# Altium project T8_SOM_Carrier.PrjPcb (part 1 of 4)
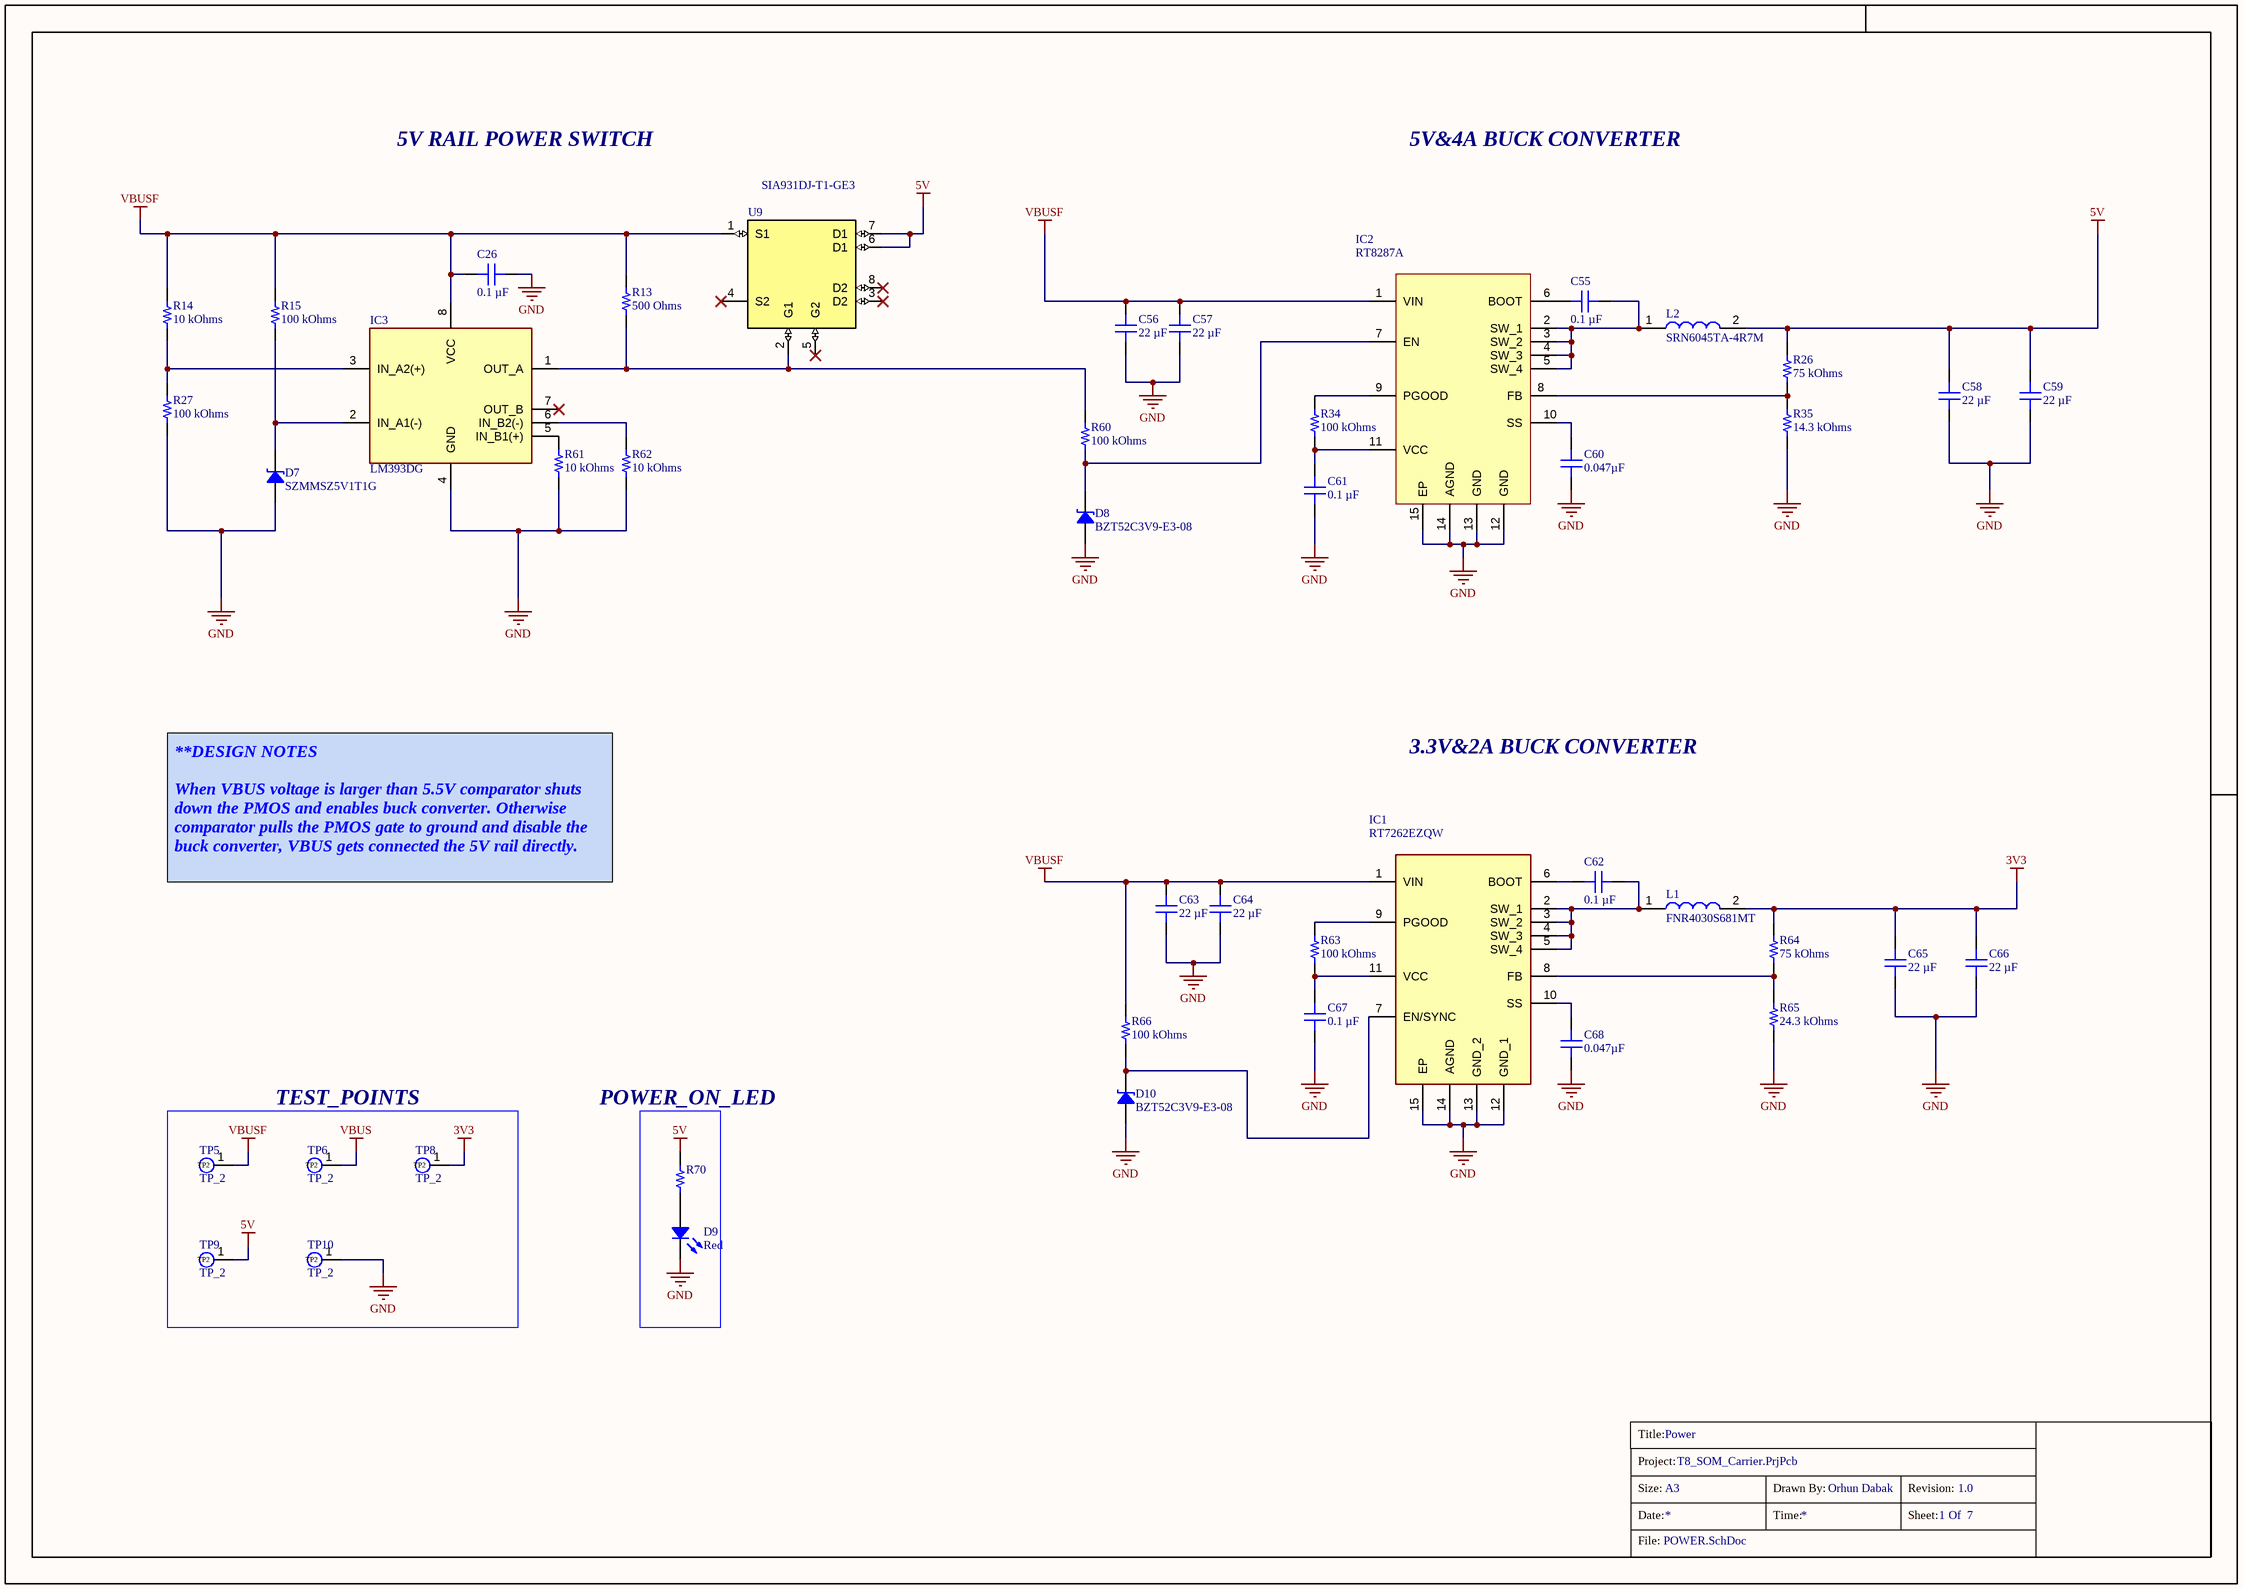
[diagram p0: POWER.SchDoc]
CAGE_CODE: ?????; CONTRACT_NUMBER: <CONTRACT NO>; DOC_NO_ASSY_DWG: <ASSY DWG NO>; DOC_NO_BOM: <BOM DOC NO>; DOC_NO_FAB_DWG: <FAB DWG NO>; DOC_NO_SCH_DWG: <SCH DWG NO>; PCB_2_DEC_TOL: +/-.01; PCB_3_DEC_TOL: +/-.010; PCB_ANG_TOL: +/-1/2; PCB_ASSEMBLY_NO: <PCB ASSY NO>; PCB_CHECKER: - -----; PCB_CHECKER_APP_DATE: --/--/----; PCB_DESIGNER: - -----; PCB_DESIGNER_APP_DATE: --/--/----; PCB_DWG_NO: <PCB DWG NO>; PCB_ENGINEER: - -----; PCB_ENGINEER_APP_DATE: --/--/----; PCB_PART_NUMBER: <PCB PN>; PCB_REV: A; SCH_REV: A
8 sheets, 247 parts. Net scope: global (net labels, ports and power ports of the same name join across sheets).
Board file: T8_SOM_Carrier.PcbDoc
Sheets:
  POWER.SchDoc
  CONFIGURATION_&_STORAGE_&_USER_LEDS_BUTTONS.SchDoc
  FTDI_&_USB.SchDoc
  USB_OTG.SchDoc
  ETHERNET.SchDoc
  ESP32_PD.SchDoc
  SYZYGY_BOARD_CONN.SchDoc
  SYZYGY_IO_PORTS.SchDoc

## Sheet POWER.SchDoc: Power
size 420 x 297 mm; DrawnBy: Orhun Dabak; Revision: 1.0; SheetNumber: 1; SheetTotal: 7; SPICEModelCacheRPHDDRHB: <root> / <DocumentId>RPHDDRHB</DocumentId> / </root>

### Parts
(Parts that share a designator on the sheet are numbered #1, #2 ... from top to bottom, then left to right.)
?#1  (no value)  (graphical)
C26  0.1 µF  [CAP 0402_1005]
C55  0.1 µF  [CAP 0402_1005]
C56  22 µF  [CAP 1812_4532 1.1MM]
C57  22 µF  [CAP 1812_4532 1.1MM]
C58  22 µF  [CAP 1210_3225 - 1MM]
C59  22 µF  [CAP 1210_3225 - 1MM]
C60  0.047µF  [CAP 0402_1005]
C61  0.1 µF  [CAP 0402_1005]
C62  0.1 µF  [CAP 0402_1005]
C63  22 µF  [CAP 1812_4532 1.1MM]
C64  22 µF  [CAP 1812_4532 1.1MM]
C65  22 µF  [CAP 1210_3225 - 1MM]
C66  22 µF  [CAP 1210_3225 - 1MM]
C67  0.1 µF  [CAP 0402_1005]
C68  0.047µF  [CAP 0402_1005]
D7  SZMMSZ5V1T1G  [SOD-123]
D8  BZT52C3V9-E3-08  [SOD-123]
D9  Red  [LED 0603_1608 RED]
D10  BZT52C3V9-E3-08  [SOD-123]
IC1  RT7262EZQW  [SON50P300X400X80-15N]
IC2  RT8287A  [SON50P300X400X80-15N]
IC3  LM393DG  [SOIC127P600X175-8N]
L1  FNR4030S681MT  [INDPM4040X300N]
L2  SRN6045TA-4R7M  [SRN6045TA4R7M]
R13  500 Ohms  [RES 0603_1608]
R14  10 kOhms  [RES 0402_1005]
R15  100 kOhms  [RES 0402_1005]
R26  75 kOhms  [RES 0402_1005]
R27  100 kOhms  [RES 0402_1005]
R34  100 kOhms  [RES 0402_1005]
R35  14.3 kOhms  [RES 0402_1005]
R60  100 kOhms  [RES 0402_1005]
R61  10 kOhms  [RES 0402_1005]
R62  10 kOhms  [RES 0402_1005]
R63  100 kOhms  [RES 0402_1005]
R64  75 kOhms  [RES 0402_1005]
R65  24.3 kOhms  [RES 0402_1005]
R66  100 kOhms  [RES 0402_1005]
R70  1 kOhms  [RES 0402_1005]  (value not drawn)
TP5  TP_2  [TEST POINT]  (no BOM)
TP6  TP_2  [TEST POINT]  (no BOM)
TP8  TP_2  [TEST POINT]  (no BOM)
TP9  TP_2  [TEST POINT]  (no BOM)
TP10  TP_2  [TEST POINT]  (no BOM)
U9  SIA931DJ-T1-GE3  [MOSFET_T1-GE3_VIS]

### Blocks framed on the sheet
TEST_POINTS: TP5 TP6 TP8-TP10

### Nets
3V3: C65.2 C66.2 L1.2 R64.1 TP8.1(TP2)
5V: C58.2 C59.2 L2.2 R26.1 R70.2 TP9.1(TP2) U9.6(D1) U9.7(D1)
GND: C26.1 C56.1 C57.1 C58.1 C59.1 C60.1 C61.1 C63.1 C64.1 C65.1 C66.1 C67.1 C68.1 D7.1 D8.1 D9.2 D10.1 IC1.12(GND_1) IC1.13(GND_2) IC1.14(AGND) IC1.15(EP) IC2.12(GND) IC2.13(GND) IC2.14(AGND) IC3.4(GND) R27.1 R35.1 R61.1 R62.1 R65.1 TP10.1(TP2)
VBUS: TP6.1(TP2)
VBUSF: C26.2 C56.2 C57.2 C63.2 C64.2 IC1.1(VIN) IC2.1(VIN) IC3.8(VCC) R13.2 R14.2 R15.2 R66.2 TP5.1(TP2) U9.1(S1)
NetC55_1: C55.1 IC2.6(BOOT)
NetC55_2: C55.2 IC2.2(SW_1) IC2.3(SW_2) IC2.4(SW_3) IC2.5(SW_4) L2.1
NetC60_2: C60.2 IC2.10(SS)
NetC61_2: C61.2 IC2.11(VCC) R34.1
NetC62_1: C62.1 IC1.6(BOOT)
NetC62_2: C62.2 IC1.2(SW_1) IC1.3(SW_2) IC1.4(SW_3) IC1.5(SW_4) L1.1
NetC67_2: C67.2 IC1.11(VCC) R63.1
NetC68_2: C68.2 IC1.10(SS)
NetD7_2: D7.2 IC3.2(IN_A1(-)) R15.1
NetD8_2: D8.2 IC2.7(EN) R60.1
NetD9_1: D9.1 R70.1
NetD10_2: D10.2 IC1.7(EN/SYNC) R66.1
NetIC1_8: IC1.8(FB) R64.2 R65.2
NetIC1_9: IC1.9(PGOOD) R63.2
NetIC2_9: IC2.9(PGOOD) R34.2
NetIC3_1: IC3.1(OUT_A) R13.1 R60.2 U9.2(G1)
NetIC3_3: IC3.3(IN_A2(+)) R14.1 R27.2
NetIC3_5: IC3.5(IN_B1(+)) R61.2
NetIC3_6: IC3.6(IN_B2(-)) R62.2
NetR26_2: R26.2 R35.2

Not connected (* = marked no-connect by the designer): IC2 8(FB) 15(EP); IC3 7(OUT_B)*; U9 3(D2)* 4(S2)* 5(G2)* 8(D2)*

### Notes on the sheet
- 5V RAIL POWER SWITCH
- 5V&4A BUCK CONVERTER
- 3.3V&2A BUCK CONVERTER
- **DESIGN NOTES
  When VBUS voltage is larger than 5.5V comparator shuts down the PMOS and enables buck converter. Otherwise comparator pulls the PMOS gate to ground and disable the buck converter, VBUS gets connected the 5V rail directly.
- POWER_ON_LED
- Title:
- Project:
- Size:
- Date:
- File:
- A3
- Time:
- Drawn By:
- Sheet:
- Revision:
- Of

### Library data of the parts
?#1 = Title_Block
C26 = GCM155R71E104KE02D: CAP CER 0.1UF 25V X7R 0402; manufacturer: Murata Electronics; Tolerance: ±10%; Part Number: GCM155R71E104KE02D; Value: 0.1 µF; Applications: Automotive; Capacitance: 0.1 µF; componentlink1description: Datasheet; componentlink1url: https://search.murata.co.jp/Ceramy/image/img/A01X/G101/ENG/GCM155R71E104KE02-01.pdf; componentlink2description: DigiKey Link; componentlink2url: https://www.digikey.com/en/products/detail/murata-electronics/GCM155R71E104KE02D/7363175; Device Package: 0402 (1005 Metric); lastupdated: 9/19/2022 12:57:33 PM; Lifecycle Status: Active; Minimum Order: 1; Mounting Type: Surface Mount, MLCC; Operating Temperature: -55°C ~ 125°C; Package / Case: 0402 (1005 Metric); packaging: TapeAndReel; partid: 2051; Part Status: Active; price: 0.01; Ratings: AEC-Q200; series: GCM; Size / Dimension: 0.039" L x 0.020" W (1.00mm x 0.50mm); Supplier 1: DigiKey; Supplier Part Number 1: 490-16431-1-ND; Temperature Coefficient: X7R; Thickness (Max): 0.022" (0.55mm); Voltage - Rated: 25V
C55 C61 C62 C67 = C0402C104K4RECAUTO: CAP CER 0402 0.1UF 16V X7R 10%; manufacturer: KEMET; Part Number: C0402C104K4RECAUTO; Value: 0.1 µF; Applications: Automotive, ESD Protection; Capacitance: 0.1 µF; componentlink1description: Datasheet; componentlink1url: https://api.kemet.com/component-edge/download/datasheet/C0402C104K4RECAUTO.pdf; componentlink2description: DigiKey Link; componentlink2url: https://www.digikey.com/en/products/detail/kemet/C0402C104K4RECAUTO/8563695; Device Package: 0402 (1005 Metric); lastupdated: 9/19/2022 12:57:36 PM; Lifecycle Status: Active; Minimum Order: 1; Mounting Type: Surface Mount, MLCC; Operating Temperature: -55°C ~ 125°C; Package / Case: 0402 (1005 Metric); packaging: TapeAndReel; partid: 1731; Part Status: Active; price: 0.01; Ratings: AEC-Q200; series: ESD SMD Auto X7R; Size / Dimension: 0.039" L x 0.020" W (1.00mm x 0.50mm); Supplier 1: DigiKey; Supplier Part Number 1: 399-17167-1-ND; Temperature Coefficient: X7R; Thickness (Max): 0.022" (0.55mm); Tolerance: ±10%; Voltage - Rated: 16V
C56 C57 C63 C64 = CGA8P1X7R1E226M250KC: CAP CER 22UF 25V X7R 1812; manufacturer: TDK Corporation; Tolerance: ±20%; Part Number: CGA8P1X7R1E226M250KC; Value: 22 µF; Applications: Automotive; Capacitance: 22 µF; componentlink1description: Datasheet; componentlink1url: https://product.tdk.com/info/en/catalog/datasheets/mlcc_automotive_general_en.pdf?ref_disty=digikey; componentlink2description: DigiKey Link; componentlink2url: https://www.digikey.com/en/products/detail/tdk-corporation/CGA8P1X7R1E226M250KC/2781336; Device Package: 1812 (4532 Metric); lastupdated: 9/19/2022 01:24:05 PM; Lifecycle Status: Active; Minimum Order: 1; Mounting Type: Surface Mount, MLCC; Operating Temperature: -55°C ~ 125°C; Package / Case: 1812 (4532 Metric); packaging: TapeAndReel; Part Status: Active; price: 0.44; Ratings: AEC-Q200; series: CGA; Size / Dimension: 0.177" L x 0.126" W (4.50mm x 3.20mm); Supplier 1: DigiKey; Supplier Part Number 1: 445-7910-1-ND; Temperature Coefficient: X7R; Thickness (Max): 0.110" (2.80mm); Voltage - Rated: 25V
C58 C59 C65 C66 = C3225X5R1C226M250AA: CAP CER 22UF 16V X5R 1210; manufacturer: TDK Corporation; Tolerance: ±20%; Part Number: C3225X5R1C226M250AA; Value: 22 µF; Applications: General Purpose; Capacitance: 22 µF; componentlink1description: Datasheet; componentlink1url: https://product.tdk.com/info/en/catalog/datasheets/mlcc_commercial_general_en.pdf?ref_disty=digikey; componentlink2description: DigiKey Link; componentlink2url: https://www.digikey.com/en/products/detail/tdk-corporation/C3225X5R1C226M250AA/569062; Device Package: 1210 (3225 Metric); Features: Low ESL; lastupdated: 9/19/2022 01:23:29 PM; Lifecycle Status: Active; Minimum Order: 1; Mounting Type: Surface Mount, MLCC; Operating Temperature: -55°C ~ 85°C; Package / Case: 1210 (3225 Metric); packaging: TapeAndReel; partid: 23912; Part Status: Active; price: 0.11; series: C; Size / Dimension: 0.126" L x 0.098" W (3.20mm x 2.50mm); Supplier 1: DigiKey; Supplier Part Number 1: 445-1436-1-ND; Temperature Coefficient: X5R; Thickness (Max): 0.110" (2.80mm); Voltage - Rated: 16V
C60 C68 = 0402YD473KAT2A: CAP CER 0.047UF 16V X5R 0402; manufacturer: AVX Corporation; Tolerance: ±10%; Part Number: 0402YD473KAT2A; Value: 0.047µF; Applications: General Purpose; Capacitance: 0.047µF; componentlink1description: Datasheet; componentlink1url: http://datasheets.avx.com/cx5r.pdf; componentlink2description: DigiKey Link; componentlink2url: http://digikey.com/product-detail/en/avx-corporation/0402YD473KAT2A/478-1125-1-ND/564157; Device Package: 0402 (1005 Metric); lastupdated: 2/8/2022 12:26:58 PM; Lifecycle Status: Active; Minimum Order: 1; Mounting Type: Surface Mount, MLCC; Operating Temperature: -55°C ~ 85°C; Package / Case: 0402 (1005 Metric); packaging: TapeAndReel; partid: 1776; Part Status: Active; price: 0.02; series: -; Size / Dimension: 0.039" L x 0.020" W (1.00mm x 0.50mm); Supplier 1: DigiKey; Supplier Part Number 1: 478-1125-1-ND; Temperature Coefficient: X5R; Thickness (Max): 0.022" (0.56mm); Voltage - Rated: 16V
D7 = SZMMSZ5V1T1G: DIODE ZENER 5.1V 500MW SOD123; Manufacturer: ON Semiconductor; Current - Reverse Leakage @ Vr: 2µA @ 2V; Impedance (Max) (Zzt): 60 Ohms; Tolerance: ±5%; Voltage - Forward (Vf) (Max) @ If: 900mV @ 10mA; Part Number: SZMMSZ5V1T1G; ComponentLink1Description: Datasheet; ComponentLink1URL: http://www.onsemi.com/pub/Collateral/MMSZ2V4T1-D.PDF; ComponentLink2Description: DigiKey Link; ComponentLink2URL: http://digikey.com/product-detail/en/on-semiconductor/SZMMSZ5V1T1G/SZMMSZ5V1T1GOSCT-ND/9087954; LastUpdated: 9/19/2022 01:47:19 PM; Lifecycle Status: Active; Minimum Order: 1; Mounting Type: Surface Mount; Operating Temperature: -55°C ~ 150°C; Package / Case: SOD-123; Packaging: TapeAndReel; PartId: 1649; Part Status: Active; Power - Max: 500mW; Price: 0.07; Series: Automotive, AEC-Q101; Supplier 1: DigiKey; Supplier Part Number 1: SZMMSZ5V1T1GOSCT-ND; Supplier Device Package: SOD-123; Voltage - Zener (Nom) (Vz): 5.1V
D8 D10 = BZT52C3V9-E3-08: DIODE ZENER 3.9V 410MW SOD123; Manufacturer: Vishay Semiconductor Diodes Division; Impedance (Max) (Zzt): 95 Ohms; Tolerance: ±5%; Part Number: BZT52C3V9-E3-08; ComponentLink1Description: Datasheet; ComponentLink1URL: http://www.vishay.com/docs/85760/bzt52.pdf; ComponentLink2Description: DigiKey Link; ComponentLink2URL: http://digikey.com/product-detail/en/vishay-semiconductor-diodes-division/BZT52C3V9-E3-08/BZT52C3V9-E3-08CT-ND/3104450; LastUpdated: 9/19/2022 01:47:20 PM; Lifecycle Status: Active; Minimum Order: 1; Mounting Type: Surface Mount; Package / Case: SOD-123; Packaging: TapeAndReel; PartId: 1628; Part Status: Active; Power - Max: 410mW; Price: 0.05; Series: -; Supplier 1: DigiKey; Supplier Part Number 1: BZT52C3V9-E3-08CT-ND; Supplier Device Package: SOD-123; Voltage - Zener (Nom) (Vz): 3.9V
D9 = LTST-C193KRKT-2A: LED RED CLEAR CHIP SMD; Manufacturer: Lite-On Inc.; Configuration: Standard; Current - Test: 2mA; Lens Color: Colorless; Lens Size: 1.15mm x 0.80mm; Lens Style: Rectangle with Flat Top; Millicandela Rating: 6.5mcd; Viewing Angle: 130°; Voltage - Forward (Vf) (Typ): 1.9V; Wavelength - Dominant: 629nm; Wavelength - Peak: 639nm; Part Number: LTST-C193KRKT-2A; Color: Red; ComponentLink1Description: Datasheet; ComponentLink1URL: //media.digikey.com/pdf/Data%20Sheets/Lite-On%20PDFs/LTST-C193KRKT-2A.pdf; ComponentLink2Description: DigiKey Link; ComponentLink2URL: http://digikey.com/product-detail/en/lite-on-inc/LTST-C193KRKT-2A/160-1909-1-ND/3694456; Device Package: 0603 (1608 Metric); Height (Max): 0.35mm; LastUpdated: 19/09/2022 13:50:25; Lens Transparency: Clear; Lifecycle Status: Active; Minimum Order: 1; Mounting Type: Surface Mount; Package / Case: 0603 (1608 Metric); Packaging: TapeAndReel; PartId: 382; Part Status: Active; Price: 0.07; Series: -; Size / Dimension: 1.60mm L x 0.80mm W; Supplier 1: DigiKey; Supplier Part Number 1: 160-1909-1-ND; Supplier Device Package: Chip LED; Value: Red
IC1 = RT7262EZQW: Integrated Circuit; Manufacturer_Name: RICHTEK; Datasheet Link: https://4donline.ihs.com/images/VipMasterIC/IC/RHTK/RHTK-S-A0013504395/RHTK-S-A0013505386-1.pdf?hkey=EF798316E3902B6ED9A73243A3159BB0; Height: 0.8mm; Manufacturer_Part_Number: RT7262EZQW
IC2 = RT8287A: Integrated Circuit
IC3 = LM393DG: Integrated Circuit; Manufacturer_Name: onsemi; Datasheet Link: https://www.onsemi.com/pub/Collateral/LM393-D.PDF; Height: 1.75mm; Manufacturer_Part_Number: LM393DG; Mouser Part Number: 863-LM393DG; Mouser Price/Stock: https://www.mouser.co.uk/ProductDetail/onsemi/LM393DG?qs=2OtswVQKCOHzXsheSqC0ow%3D%3D; Arrow Part Number: LM393DG; Arrow Price/Stock: https://www.arrow.com/en/products/lm393dg/on-semiconductor?region=nac
L1 = FNR4030S681MT: Inductor; Manufacturer_Name: cjiang(Changjiang Microelectronics Tech); Datasheet Link: https://datasheet.lcsc.com/szlcsc/1811101034_cjiang-Changjiang-Microelectronics-Tech-FNR4030S681MT_C167903.pdf; Height: 3mm; Manufacturer_Part_Number: FNR4030S681MT
L2 = SRN6045TA-4R7M: Inductor; Manufacturer_Name: Bourns; Datasheet Link: https://componentsearchengine.com/Datasheets/1/SRN6045TA-4R7M.pdf; Height: 4.5mm; Manufacturer_Part_Number: SRN6045TA-4R7M; Mouser Part Number: 652-SRN6045TA-4R7M; Mouser Price/Stock: https://www.mouser.co.uk/ProductDetail/Bourns/SRN6045TA-4R7M?qs=Vt59ZOdFuWbecpvj2tHgcA%3D%3D; Arrow Part Number: SRN6045TA-4R7M; Arrow Price/Stock: https://www.arrow.com/en/products/srn6045ta-4r7m/bourns?region=nac
R13 = TNPU0603500RAZEN00: RES SMD 500 OHM 0.05% 1/10W 0603; Manufacturer: Vishay Dale; Power (Watts): 0.1W, 1/10W; Temperature Coefficient: ±5ppm/°C; Part Number: TNPU0603500RAZEN00; Value: 500 Ohms; ComponentLink1Description: Datasheet; ComponentLink1URL: http://www.vishay.com/docs/28779/tnpue3.pdf; ComponentLink2Description: DigiKey Link; ComponentLink2URL: http://digikey.com/product-detail/en/vishay-dale/TNPU0603500RAZEN00/541-3301-1-ND/6615958; Composition: Thin Film; Device Package: 0603 (1608 Metric); Features: Anti-Sulfur, Automotive AEC-Q200, Moisture Resistant; Height - Seated (Max): 0.022" (0.55mm); LastUpdated: 9/19/2022 01:22:08 PM; Lifecycle Status: Active; Minimum Order: 1; Number of Terminations: 2; Operating Temperature: -55°C ~ 125°C; Package / Case: 0603 (1608 Metric); Packaging: TapeAndReel; PartId: 11840; Part Status: Active; Price: 1.20; Ratings: AEC-Q200; Resistance: 500 Ohms; Series: TNPU; Size / Dimension: 0.063" L x 0.033" W (1.60mm x 0.85mm); Supplier 1: DigiKey; Supplier Part Number 1: 541-3301-1-ND; Supplier Device Package: 0603; Tolerance: ±0.05%
R14 R61 R62 = RP73PF1E10KBTD: RES 10K OHM 0.1% 1/10W 0402; Manufacturer: TE Connectivity Passive Product; Power (Watts): 0.1W, 1/10W; Temperature Coefficient: ±25ppm/°C; Part Number: RP73PF1E10KBTD; Value: 10 kOhms; ComponentLink1Description: Datasheet; ComponentLink1URL: https://www.te.com/commerce/DocumentDelivery/DDEController?Action=srchrtrv&DocNm=1773272&DocType=DS&DocLang=English; ComponentLink2Description: DigiKey Link; ComponentLink2URL: https://www.digikey.com/en/products/detail/te-connectivity-passive-product/RP73PF1E10KBTD/8260957; Composition: Thin Film; Device Package: 0402 (1005 Metric); Height - Seated (Max): 0.014" (0.35mm); LastUpdated: 9/19/2022 01:15:04 PM; Lifecycle Status: Active; Minimum Order: 1; Number of Terminations: 2; Operating Temperature: -55°C ~ 155°C; Package / Case: 0402 (1005 Metric); Packaging: TapeAndReel; PartId: 2434; Part Status: Active; Price: 0.09; Resistance: 10 kOhms; Series: RP73, Holsworthy; Size / Dimension: 0.039" L x 0.020" W (1.00mm x 0.50mm); Supplier 1: DigiKey; Supplier Part Number 1: A127415CT-ND; Supplier Device Package: 0402; Tolerance: ±0.1%
R15 R27 R34 R60 R63 R66 = RP73PF1E100KBTD: RES 100K OHM 0.1% 1/10W 0402; Manufacturer: TE Connectivity Passive Product; Power (Watts): 0.1W, 1/10W; Temperature Coefficient: ±25ppm/°C; Part Number: RP73PF1E100KBTD; Value: 100 kOhms; ComponentLink1Description: Datasheet; ComponentLink1URL: https://www.te.com/commerce/DocumentDelivery/DDEController?Action=srchrtrv&DocNm=1773272&DocType=DS&DocLang=English; ComponentLink2Description: DigiKey Link; ComponentLink2URL: https://www.digikey.com/en/products/detail/te-connectivity-passive-product/RP73PF1E100KBTD/8261053; Composition: Thin Film; Device Package: 0402 (1005 Metric); Height - Seated (Max): 0.014" (0.35mm); LastUpdated: 9/19/2022 01:15:04 PM; Lifecycle Status: Active; Minimum Order: 1; Number of Terminations: 2; Operating Temperature: -55°C ~ 155°C; Package / Case: 0402 (1005 Metric); Packaging: TapeAndReel; PartId: 2436; Part Status: Active; Price: 0.08; Resistance: 100 kOhms; Series: RP73, Holsworthy; Size / Dimension: 0.039" L x 0.020" W (1.00mm x 0.50mm); Supplier 1: DigiKey; Supplier Part Number 1: A127511CT-ND; Supplier Device Package: 0402; Tolerance: ±0.1%
R26 R64 = RC0402FR-0775KL: RES 75K OHM 1% 1/16W 0402; Manufacturer: Yageo; Power (Watts): 0.063W, 1/16W; Temperature Coefficient: ±100ppm/°C; Part Number: RC0402FR-0775KL; Value: 75 kOhms; ComponentLink1Description: Datasheet; ComponentLink1URL: https://www.yageo.com/upload/media/product/productsearch/datasheet/rchip/PYu-RC_Group_51_RoHS_L_10.pdf; ComponentLink2Description: DigiKey Link; ComponentLink2URL: https://www.digikey.com/en/products/detail/yageo/RC0402FR-0775KL/2827576; Composition: Thick Film; Device Package: 0402 (1005 Metric); Features: Moisture Resistant; Height - Seated (Max): 0.016" (0.40mm); LastUpdated: 9/19/2022 01:15:04 PM; Lifecycle Status: Active; Minimum Order: 1; Number of Terminations: 2; Operating Temperature: -55°C ~ 155°C; Package / Case: 0402 (1005 Metric); Packaging: CutTape; PartId: 2636; Part Status: Active; Price: 0.01; Resistance: 75 kOhms; Series: RC_L; Size / Dimension: 0.039" L x 0.020" W (1.00mm x 0.50mm); Supplier 1: DigiKey; Supplier Part Number 1: 311-75KLRCT-ND; Supplier Device Package: 0402; Tolerance: ±1%
R35 = RQ73C1E14K3BTD: RES 14.3 KOHMS 0.1% 1/16W 0402; Manufacturer: TE Connectivity Passive Product; Power (Watts): 0.063W, 1/16W; Temperature Coefficient: ±10ppm/°C; Part Number: RQ73C1E14K3BTD; Value: 14.3 kOhms; ComponentLink1Description: Datasheet; ComponentLink1URL: //media.digikey.com/pdf/Data%20Sheets/Tyco%20Electronics%20P%20B%20PDFs/RQ73-0618%20v2.pdf; ComponentLink2Description: DigiKey Link; ComponentLink2URL: https://www.digikey.com/en/products/detail/te-connectivity-passive-product/RQ73C1E14K3BTD/9480071; Composition: Thin Film; Device Package: 0402 (1005 Metric); Features: Anti-Sulfur, Automotive AEC-Q200; Height - Seated (Max): 0.016" (0.40mm); LastUpdated: 9/19/2022 01:14:47 PM; Lifecycle Status: Active; Minimum Order: 1; Number of Terminations: 2; Operating Temperature: -55°C ~ 155°C; Package / Case: 0402 (1005 Metric); Packaging: TapeAndReel; PartId: 7354; Part Status: Active; Price: 0.28; Ratings: AEC-Q200; Resistance: 14.3 kOhms; Series: RQ73; Size / Dimension: 0.039" L x 0.020" W (1.00mm x 0.50mm); Supplier 1: DigiKey; Supplier Part Number 1: A140123CT-ND; Supplier Device Package: 0402; Tolerance: ±0.1%
R65 = RC0402FR-0724K3L: RES 24.3K OHM 1% 1/16W 0402; Manufacturer: Yageo; Power (Watts): 0.063W, 1/16W; Temperature Coefficient: ±100ppm/°C; Part Number: RC0402FR-0724K3L; Value: 24.3 kOhms; ComponentLink1Description: Datasheet; ComponentLink1URL: https://www.yageo.com/upload/media/product/productsearch/datasheet/rchip/PYu-RC_Group_51_RoHS_L_10.pdf; ComponentLink2Description: DigiKey Link; ComponentLink2URL: https://www.digikey.com/en/products/detail/yageo/RC0402FR-0724K3L/5280931; Composition: Thick Film; Device Package: 0402 (1005 Metric); Features: Moisture Resistant; Height - Seated (Max): 0.016" (0.40mm); LastUpdated: 9/19/2022 01:15:03 PM; Lifecycle Status: Active; Minimum Order: 1; Number of Terminations: 2; Operating Temperature: -55°C ~ 155°C; Package / Case: 0402 (1005 Metric); Packaging: CutTape; PartId: 2738; Part Status: Active; Price: 0.01; Resistance: 24.3 kOhms; Series: RC_L; Size / Dimension: 0.039" L x 0.020" W (1.00mm x 0.50mm); Supplier 1: DigiKey; Supplier Part Number 1: YAG3071CT-ND; Supplier Device Package: 0402; Tolerance: ±1%
R70 = AC0402FR-071KL: RES SMD 1K OHM 1% 1/16W 0402; Manufacturer: Yageo; Power (Watts): 0.063W, 1/16W; Temperature Coefficient: ±100ppm/°C; Part Number: AC0402FR-071KL; Value: 1 kOhms; ComponentLink1Description: Datasheet; ComponentLink1URL: https://www.yageo.com/upload/media/product/productsearch/datasheet/rchip/PYu-AC_51_RoHS_L_7.pdf; ComponentLink2Description: DigiKey Link; ComponentLink2URL: https://www.digikey.com/en/products/detail/yageo/AC0402FR-071KL/2827801; Composition: Thick Film; Device Package: 0402 (1005 Metric); Features: Automotive AEC-Q200, Moisture Resistant; Height - Seated (Max): 0.015" (0.37mm); LastUpdated: 19/09/2022 13:14:31; Lifecycle Status: Active; Minimum Order: 1; Number of Terminations: 2; Operating Temperature: -55°C ~ 155°C; Package / Case: 0402 (1005 Metric); Packaging: CutTape; PartId: 12037; Part Status: Active; Price: 0.01; Ratings: AEC-Q200; Resistance: 1 kOhms; Series: AC; Size / Dimension: 0.039" L x 0.020" W (1.00mm x 0.50mm); Supplier 1: DigiKey; Supplier Part Number 1: 311-1KLBCT-ND; Supplier Device Package: 0402; Tolerance: ±1%
TP5 TP6 TP8-TP10 = TEST POINT_2: 1.5x1.5mm Test Point
U9 = SIA931DJ-T1-GE3: No Description Available; Mfr_Name: Vishay; Copyright: Copyright (C) 2022 Ultra Librarian. All rights reserved.; Manufacturer_Part_Number: SIA931DJ-T1-GE3; Digi-Key_Part_Number_1: SIA931DJ-T1-GE3TR-ND; Digi-Key_Part_Number_2: SIA931DJ-T1-GE3CT-ND; Digi-Key_Part_Number_3: SIA931DJ-T1-GE3DKR-ND; RefDes: RefDes; Type: DEV

## Sheet CONFIGURATION_&_STORAGE_&_USER_LEDS_BUTTONS.SchDoc: CONFIGURATION_&_STORAGE_&_USER_LEDS_BUTTONS
size 420 x 297 mm; DrawnBy: Orhun Dabak; Revision: 1.0; SheetNumber: 8; SheetTotal: 7
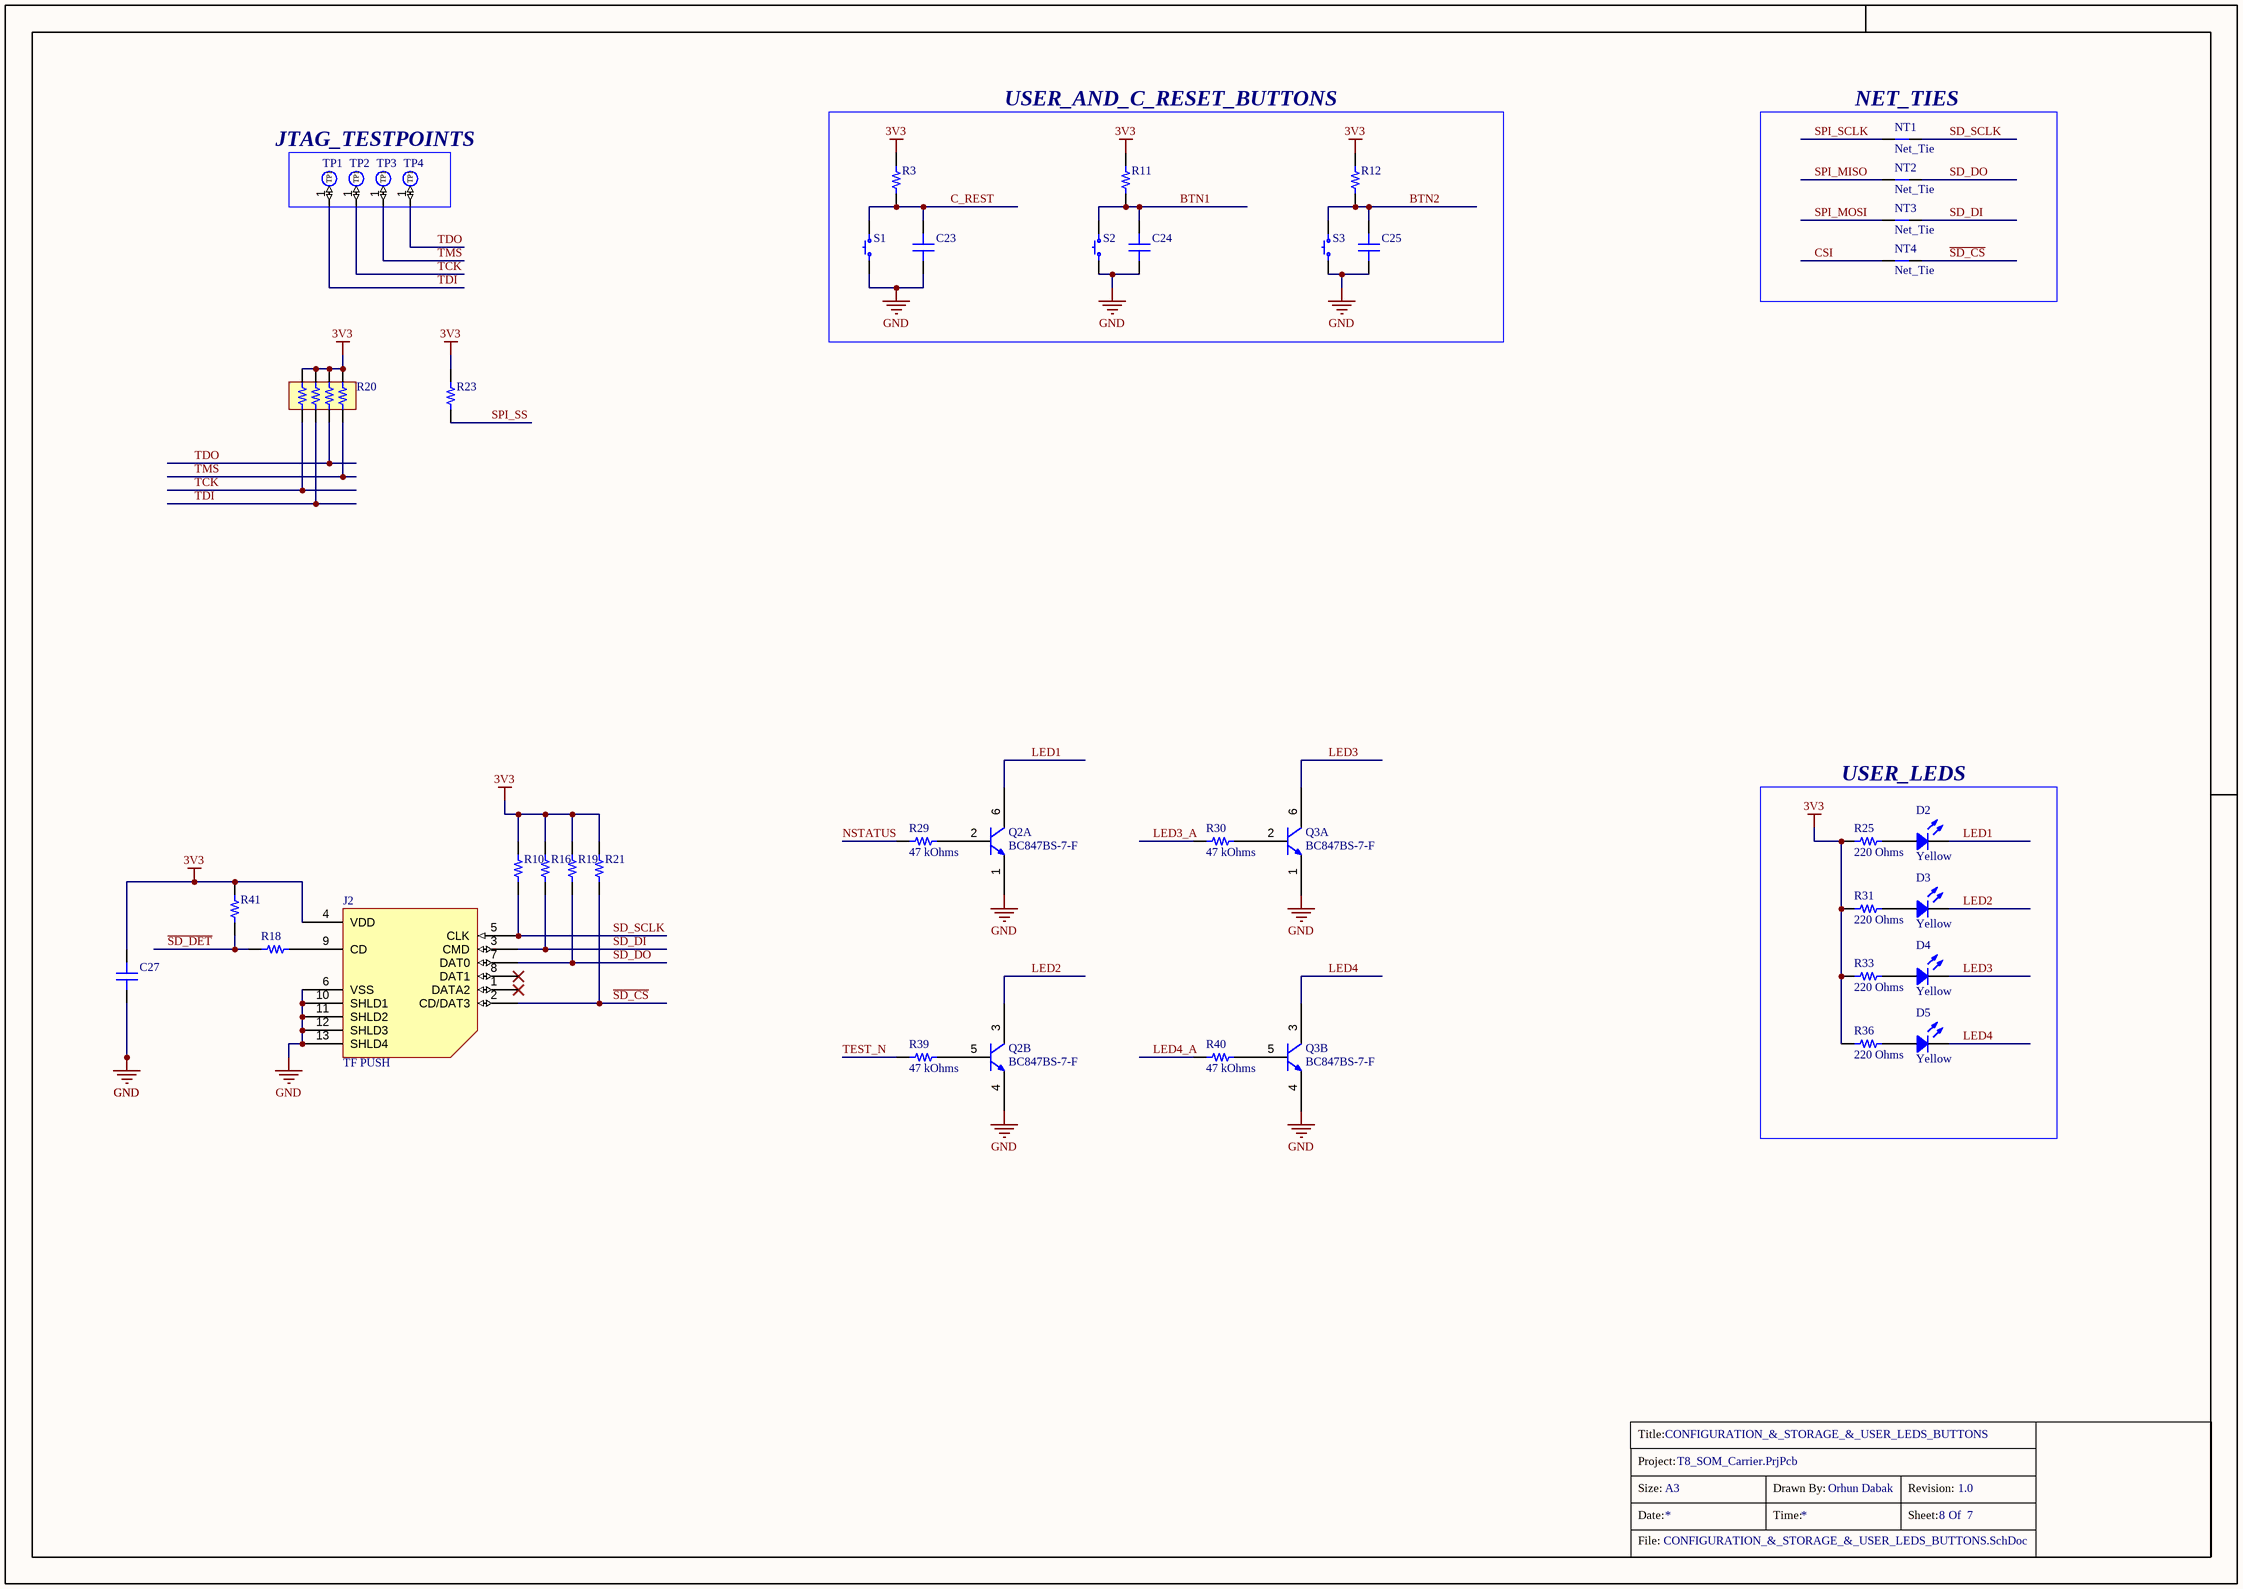
[diagram p1: CONFIGURATION_&_STORAGE_&_USER_LEDS_BUTTONS.SchDoc]

### Parts
(Parts that share a designator on the sheet are numbered #1, #2 ... from top to bottom, then left to right.)
?#2  (no value)  (graphical)
C23  10 µF  [CAP 0402_1005]  (value not drawn)
C24  10 µF  [CAP 0402_1005]  (value not drawn)
C25  10 µF  [CAP 0402_1005]  (value not drawn)
C27  0.1 µF  [CAP 0402_1005]  (value not drawn)
D2  Yellow  [LED 0603_1608 YELLOW]
D3  Yellow  [LED 0603_1608 YELLOW]
D4  Yellow  [LED 0603_1608 YELLOW]
D5  Yellow  [LED 0603_1608 YELLOW]
J2  TF PUSH  [TF PUSH]
NT1  Net_Tie  [Net_Tie 0.2X0.2]  (net tie, no BOM)
NT2  Net_Tie  [Net_Tie 0.2X0.2]  (net tie, no BOM)
NT3  Net_Tie  [Net_Tie 0.2X0.2]  (net tie, no BOM)
NT4  Net_Tie  [Net_Tie 0.2X0.2]  (net tie, no BOM)
Q2  BC847BS-7-F  [BC847BS-7-F-Footprint-1]  (parts A,B of 2)
Q3  BC847BS-7-F  [BC847BS-7-F-Footprint-1]  (parts A,B of 2)
R3  10 kOhms  [RES 0201_0603]  (value not drawn)
R10  10 kOhms  [RES 0201_0603]  (value not drawn)
R11  10 kOhms  [RES 0201_0603]  (value not drawn)
R12  10 kOhms  [RES 0201_0603]  (value not drawn)
R16  10 kOhms  [RES 0201_0603]  (value not drawn)
R18  0 Ohms  [RES 0201_0603]  (value not drawn)
R19  10 kOhms  [RES 0201_0603]  (value not drawn)
R20  YC124-JR-0710KL  [RESNET 0804-8 CONVEX]  (value not drawn)
R21  10 kOhms  [RES 0201_0603]  (value not drawn)
R23  10 kOhms  [RES 0201_0603]  (value not drawn)
R25  220 Ohms  [RES 0402_1005]
R29  47 kOhms  [RES 0201_0603]
R30  47 kOhms  [RES 0201_0603]
R31  220 Ohms  [RES 0402_1005]
R33  220 Ohms  [RES 0402_1005]
R36  220 Ohms  [RES 0402_1005]
R39  47 kOhms  [RES 0201_0603]
R40  47 kOhms  [RES 0201_0603]
R41  100 kOhms  [RES 0201_0603]  (value not drawn)
S1  TS342A2P-WZ  [TS342A2P-WZ]  (value not drawn)
S2  TS342A2P-WZ  [TS342A2P-WZ]  (value not drawn)
S3  TS342A2P-WZ  [TS342A2P-WZ]  (value not drawn)
TP1  TP_1  [TEST POINT]  (value not drawn)  (no BOM)
TP2  TP_1  [TEST POINT]  (value not drawn)  (no BOM)
TP3  TP_1  [TEST POINT]  (value not drawn)  (no BOM)
TP4  TP_1  [TEST POINT]  (value not drawn)  (no BOM)

### Blocks framed on the sheet
USER_AND_C_RESET_BUTTONS: C23-C25 R3 R11 R12 S1-S3
NET_TIES: NT1-NT4
USER_LEDS: D2-D5 R25 R31 R33 R36

### Nets
3V3: C27.2 J2.4(VDD) R3.2 R10.2 R11.2 R12.2 R16.2 R19.2 R20.5 R20.6 R20.7 R20.8 R21.2 R23.2 R25.1 R31.1 R33.1 R36.1 R41.2
GND: C23.1 C24.1 C25.1 C27.1 J2.6(VSS) J2.10(SHLD1) J2.11(SHLD2) J2.12(SHLD3) J2.13(SHLD4) Q2.1(Emitter) Q2.4(Emitter) Q3.1(Emitter) Q3.4(Emitter) S1.1 S2.1 S3.1
BTN1: C24.2 R11.1 S2.2
BTN2: C25.2 R12.1 S3.2
C_REST: C23.2 R3.1 S1.2
CSI: NT4.1
LED1: D2.2 Q2.6(Collector)
LED2: D3.2 Q2.3(Collector)
LED3: D4.2 Q3.6(Collector)
LED3_A: R30.1
LED4: D5.2 Q3.3(Collector)
LED4_A: R40.1
NSTATUS: R29.1
~{SD_CS}: J2.2(CD/DAT3) NT4.2 R21.1
~{SD_DET}: R18.1 R41.1
SD_DI: J2.3(CMD) NT3.2 R16.1
SD_DO: J2.7(DAT0) NT2.2 R19.1
SD_SCLK: J2.5(CLK) NT1.2 R10.1
SPI_MISO: NT2.1
SPI_MOSI: NT3.1
SPI_SCLK: NT1.1
SPI_SS: R23.1
TCK: R20.1 TP2.1(TP1)
TDI: R20.2 TP1.1(TP1)
TDO: R20.3 TP4.1(TP1)
TEST_N: R39.1
TMS: R20.4 TP3.1(TP1)
NetD2_1: D2.1 R25.2
NetD3_1: D3.1 R31.2
NetD4_1: D4.1 R33.2
NetD5_1: D5.1 R36.2
NetJ2_9: J2.9(CD) R18.2
NetQ2_2: Q2.2(Base) R29.2
NetQ2_5: Q2.5(Base) R39.2
NetQ3_2: Q3.2(Base) R30.2
NetQ3_5: Q3.5(Base) R40.2

Not connected (* = marked no-connect by the designer): J2 1(DATA2)* 8(DAT1)*

### Notes on the sheet
- JTAG_TESTPOINTS
- Title:
- Project:
- Size:
- Date:
- File:
- A3
- Time:
- Drawn By:
- Sheet:
- Revision:
- Of

### Library data of the parts
?#2 = Title_Block
C23-C25 = GRM155R61A106ME11D: CAP CER 10UF 10V X5R 0402; manufacturer: Murata Electronics; Tolerance: ±20%; Part Number: GRM155R61A106ME11D; Value: 10 µF; Applications: General Purpose; Capacitance: 10 µF; componentlink2description: DigiKey Link; componentlink2url: https://www.digikey.com/en/products/detail/murata-electronics/GRM155R61A106ME11D/12091056; Device Package: 0402 (1005 Metric); lastupdated: 19/09/2022 12:56:37; Lifecycle Status: Active; Minimum Order: 1; Mounting Type: Surface Mount, MLCC; Operating Temperature: -55°C ~ 85°C; Package / Case: 0402 (1005 Metric); packaging: TapeAndReel; partid: 45464; Part Status: Active; price: 0.02; series: GRM; Size / Dimension: 0.039" L x 0.020" W (1.00mm x 0.50mm); Supplier 1: DigiKey; Supplier Part Number 1: 490-GRM155R61A106ME11DCT-ND; Temperature Coefficient: X5R; Thickness (Max): 0.028" (0.70mm); Voltage - Rated: 10V
C27 = CC0402KRX7R6BB104: CAP CER 0.1UF 10V X7R 0402; manufacturer: Yageo; Tolerance: ±10%; Part Number: CC0402KRX7R6BB104; Value: 0.1 µF; Applications: General Purpose; Capacitance: 0.1 µF; componentlink1description: Datasheet; componentlink1url: https://www.yageo.com/upload/media/product/productsearch/datasheet/mlcc/UPY-GPHC_X7R_6.3V-to-50V_18.pdf; componentlink2description: DigiKey Link; componentlink2url: https://www.digikey.com/en/products/detail/yageo/CC0402KRX7R6BB104/2103083; Device Package: 0402 (1005 Metric); lastupdated: 19/09/2022 12:57:28; Lifecycle Status: Active; Minimum Order: 1; Mounting Type: Surface Mount, MLCC; Operating Temperature: -55°C ~ 125°C; Package / Case: 0402 (1005 Metric); packaging: CutTape; partid: 3877; Part Status: Active; price: 0.01; series: CC; Size / Dimension: 0.039" L x 0.020" W (1.00mm x 0.50mm); Supplier 1: DigiKey; Supplier Part Number 1: 311-1345-1-ND; Temperature Coefficient: X7R; Thickness (Max): 0.022" (0.55mm); Voltage - Rated: 10V
D2-D5 = SML-LX0603YW-TR: LED YELLOW DIFFUSED SMD; Manufacturer: Lumex Opto/Components Inc.; Configuration: Standard; Current - Test: 20mA; Lens Color: White; Lens Size: 1.00mm x 0.80mm; Lens Style: Rectangle with Flat Top; Millicandela Rating: 14mcd; Viewing Angle: 160°; Voltage - Forward (Vf) (Typ): 2.1V; Wavelength - Peak: 585nm; Part Number: SML-LX0603YW-TR; Color: Yellow; ComponentLink1Description: Datasheet; ComponentLink1URL: https://www.lumex.com/content/files/ProductAttachment/SML-LX0603YW-TR.pdf; ComponentLink2Description: DigiKey Link; ComponentLink2URL: https://www.digikey.com/en/products/detail/lumex-opto-components-inc/SML-LX0603YW-TR/304361; Device Package: 0603 (1608 Metric); Height (Max): 0.60mm; LastUpdated: 19/09/2022 13:51:05; Lens Transparency: Diffused; Lifecycle Status: Active; Minimum Order: 1; Mounting Type: Surface Mount; Package / Case: 0603 (1608 Metric); Packaging: TapeAndReel; PartId: 92; Part Status: Active; Price: 0.05; Series: -; Size / Dimension: 1.60mm L x 0.80mm W; Supplier 1: DigiKey; Supplier Part Number 1: 67-1550-1-ND; Value: Yellow
J2 = TF PUSH: -20℃~+90℃ 2mm Deck MicroSD card (TF card) Self bomb SMD SD Card Connectors ROHS; Manufacturer: SHOU HAN; ComponentLink1Description: Datasheet; ComponentLink1URL: https://datasheet.lcsc.com/lcsc/1912111437_SHOU-HAN-TF-PUSH_C393941.pdf; ComponentLink2Description: LCSC Link; ComponentLink2URL: https://www.lcsc.com/product-detail/SD-Card-Connectors_SHOU-HAN-TF-PUSH_C393941.html; Manufacturer Part Number: TF PUSH; LCSC Part Number: C393941; Package: SMD; Category: Connectors/SD Card Connectors; Operating Temperature Range: -20℃~+90℃; Maximum Body Height: 2mm; Connector Type: Deck; Card Type: MicroSD card (TF card); Card Connection Mode: Self bomb
NT1-NT4 = Net_Tie: Net Tie
Q2 Q3 = CMP-013-00035-3: 2NPN Ic=100mA Vceo=45V hfe=200~450 P=200mW SOT363
R3 R11 R12 R23 = RC0201FR-0710KL: RES 10K OHM 1% 1/20W 0201; Manufacturer: Yageo; Power (Watts): 0.05W, 1/20W; Temperature Coefficient: ±200ppm/°C; Part Number: RC0201FR-0710KL; Value: 10 kOhms; ComponentLink1Description: Datasheet; ComponentLink1URL: https://www.yageo.com/upload/media/product/productsearch/datasheet/rchip/PYu-RC_Group_51_RoHS_L_10.pdf; ComponentLink2Description: DigiKey Link; ComponentLink2URL: https://www.digikey.com/en/products/detail/yageo/RC0201FR-0710KL/1948870; Composition: Thick Film; Device Package: 0201 (0603 Metric); Features: Moisture Resistant; Height - Seated (Max): 0.010" (0.26mm); LastUpdated: 19/09/2022 13:09:03; Lifecycle Status: Active; Minimum Order: 1; Number of Terminations: 2; Operating Temperature: -55°C ~ 125°C; Package / Case: 0201 (0603 Metric); Packaging: CutTape; PartId: 2281; Part Status: Active; Price: 0.01; Resistance: 10 kOhms; Series: RC_L; Size / Dimension: 0.024" L x 0.012" W (0.60mm x 0.30mm); Supplier 1: DigiKey; Supplier Part Number 1: 311-10.0KMCT-ND; Supplier Device Package: 0201; Tolerance: ±1%
R10 R16 R19 R21 = CRCW020110K0FKED: RES SMD 10K OHM 1% 1/20W 0201; Manufacturer: Vishay Dale; Power (Watts): 0.05W, 1/20W; Temperature Coefficient: ±100ppm/°C; Part Number: CRCW020110K0FKED; Value: 10 kOhms; ComponentLink1Description: Datasheet; ComponentLink1URL: http://www.vishay.com/docs/20052/crcw0201e3.pdf; ComponentLink2Description: DigiKey Link; ComponentLink2URL: https://www.digikey.com/en/products/detail/vishay-dale/CRCW020110K0FKED/1967989; Composition: Thick Film; Device Package: 0201 (0603 Metric); Height - Seated (Max): 0.010" (0.26mm); LastUpdated: 9/19/2022 01:09:18 PM; Lifecycle Status: Active; Minimum Order: 1; Number of Terminations: 2; Operating Temperature: -55°C ~ 155°C; Package / Case: 0201 (0603 Metric); Packaging: TapeAndReel; PartId: 29; Part Status: Active; Price: 0.03; Resistance: 10 kOhms; Series: CRCW; Size / Dimension: 0.024" L x 0.012" W (0.60mm x 0.30mm); Supplier 1: DigiKey; Supplier Part Number 1: 541-10.0KAABCT-ND; Supplier Device Package: 0201; Tolerance: ±1%
R18 = RC0201JR-070RL: RES 0 OHM JUMPER 1/20W 0201; Manufacturer: Yageo; Power (Watts): 0.05W, 1/20W; Part Number: RC0201JR-070RL; Value: 0 Ohms; ComponentLink1Description: Datasheet; ComponentLink1URL: https://www.yageo.com/upload/media/product/productsearch/datasheet/rchip/PYu-RC_Group_51_RoHS_L_10.pdf; ComponentLink2Description: DigiKey Link; ComponentLink2URL: https://www.digikey.com/en/products/detail/yageo/RC0201JR-070RL/1948898; Composition: Thick Film; Device Package: 0201 (0603 Metric); Features: Moisture Resistant; Height - Seated (Max): 0.010" (0.26mm); LastUpdated: 19/09/2022 13:09:03; Lifecycle Status: Active; Minimum Order: 1; Number of Terminations: 2; Operating Temperature: -55°C ~ 125°C; Package / Case: 0201 (0603 Metric); Packaging: CutTape; PartId: 2293; Part Status: Active; Price: 0.01; Resistance: 0 Ohms; Series: RC_L; Size / Dimension: 0.024" L x 0.012" W (0.60mm x 0.30mm); Supplier 1: DigiKey; Supplier Part Number 1: 311-0.0NCT-ND; Supplier Device Package: 0201; Tolerance: Jumper
R20 = YC124-JR-0710KL: RES ARRAY 4 RES 10K OHM 0804; Manufacturer: Yageo; Circuit Type: Isolated; Number of Resistors: 4; Power Per Element: 62.5mW; Temperature Coefficient: ±200ppm/°C; Tolerance: ±5%; Part Number: YC124-JR-0710KL; Applications: Automotive AEC-Q200, DDRAM, SDRAM; ComponentLink1Description: Datasheet; ComponentLink1URL: https://www.yageo.com/upload/media/product/productsearch/datasheet/rchip/PYu-YC_TC_group_51_RoHS_L_9.pdf; ComponentLink2Description: DigiKey Link; ComponentLink2URL: https://www.digikey.com/en/products/detail/yageo/YC124-JR-0710KL/1005019; Height - Seated (Max): 0.022" (0.55mm); LastUpdated: 19/09/2022 13:54:50; Lifecycle Status: Active; Minimum Order: 1; Mounting Type: Surface Mount; Number of Pins: 8; Operating Temperature: -55°C ~ 155°C; Package / Case: 0804, Convex, Long Side Terminals; Packaging: TapeAndReel; PartId: 471; Part Status: Active; Price: 0.01; Resistance (Ohms): 10k; Series: YC124; Size / Dimension: 0.079" L x 0.039" W (2.00mm x 1.00mm); Supplier 1: DigiKey; Supplier Part Number 1: YC124J-10KCT-ND
R25 R31 R33 R36 = RC0402FR-07220RL: RES 220 OHM 1% 1/16W 0402; Manufacturer: Yageo; Power (Watts): 0.063W, 1/16W; Temperature Coefficient: ±100ppm/°C; Part Number: RC0402FR-07220RL; Value: 220 Ohms; ComponentLink1Description: Datasheet; ComponentLink1URL: https://www.yageo.com/upload/media/product/productsearch/datasheet/rchip/PYu-RC_Group_51_RoHS_L_10.pdf; ComponentLink2Description: DigiKey Link; ComponentLink2URL: https://www.digikey.com/en/products/detail/yageo/RC0402FR-07220RL/726565; Composition: Thick Film; Device Package: 0402 (1005 Metric); Features: Moisture Resistant; Height - Seated (Max): 0.016" (0.40mm); LastUpdated: 19/09/2022 13:14:14; Lifecycle Status: Active; Minimum Order: 1; Number of Terminations: 2; Operating Temperature: -55°C ~ 155°C; Package / Case: 0402 (1005 Metric); Packaging: CutTape; PartId: 17956; Part Status: Active; Price: 0.01; Resistance: 220 Ohms; Series: RC_L; Size / Dimension: 0.039" L x 0.020" W (1.00mm x 0.50mm); Supplier 1: DigiKey; Supplier Part Number 1: 311-220LRCT-ND; Supplier Device Package: 0402; Tolerance: ±1%
R29 R30 R39 R40 = RC0201FR-0747KL: RES 47K OHM 1% 1/20W 0201; Manufacturer: Yageo; Power (Watts): 0.05W, 1/20W; Temperature Coefficient: ±200ppm/°C; Part Number: RC0201FR-0747KL; Value: 47 kOhms; ComponentLink1Description: Datasheet; ComponentLink1URL: https://www.yageo.com/upload/media/product/productsearch/datasheet/rchip/PYu-RC_Group_51_RoHS_L_10.pdf; ComponentLink2Description: DigiKey Link; ComponentLink2URL: https://www.digikey.com/en/products/detail/yageo/RC0201FR-0747KL/3202409; Composition: Thick Film; Device Package: 0201 (0603 Metric); Features: Moisture Resistant; Height - Seated (Max): 0.010" (0.26mm); LastUpdated: 19/09/2022 13:09:03; Lifecycle Status: Active; Minimum Order: 1; Number of Terminations: 2; Operating Temperature: -55°C ~ 125°C; Package / Case: 0201 (0603 Metric); Packaging: CutTape; PartId: 2291; Part Status: Active; Price: 0.01; Resistance: 47 kOhms; Series: RC_L; Size / Dimension: 0.024" L x 0.012" W (0.60mm x 0.30mm); Supplier 1: DigiKey; Supplier Part Number 1: 311-47KMCT-ND; Supplier Device Package: 0201; Tolerance: ±1%
R41 = CRG0201F100K: RES SMD 100K OHM 1% 1/20W 0201; Manufacturer: TE Connectivity Passive Product; Power (Watts): 0.05W, 1/20W; Temperature Coefficient: ±200ppm/°C; Part Number: CRG0201F100K; Value: 100 kOhms; ComponentLink1Description: Datasheet; ComponentLink1URL: https://www.te.com/commerce/DocumentDelivery/DDEController?Action=srchrtrv&DocNm=1773204&DocType=DS&DocLang=English; ComponentLink2Description: DigiKey Link; ComponentLink2URL: https://www.digikey.com/en/products/detail/te-connectivity-passive-product/CRG0201F100K/4489642; Composition: Thick Film; Device Package: 0201 (0603 Metric); Height - Seated (Max): 0.010" (0.26mm); LastUpdated: 9/19/2022 01:09:18 PM; Lifecycle Status: Active; Minimum Order: 1; Number of Terminations: 2; Operating Temperature: -55°C ~ 155°C; Package / Case: 0201 (0603 Metric); Packaging: TapeAndReel; PartId: 2; Part Status: Active; Price: 0.02; Resistance: 100 kOhms; Series: CRG, Neohm; Size / Dimension: 0.024" L x 0.012" W (0.60mm x 0.30mm); Supplier 1: DigiKey; Supplier Part Number 1: A129572CT-ND; Supplier Device Package: 0201; Tolerance: ±1%
S1-S3 = TS342A2P-WZ: NO SMDSplicing 50mA 3.95mm 100MΩ 30000 12V 2.9mm -25℃~+70℃ 2mm Black Round Button Brick nogging SPST SMD Tactile Switches ROHS; Manufacturer: SHOU HAN; Mechanical Life: 30000; ComponentLink1Description: Datasheet; ComponentLink1URL: https://datasheet.lcsc.com/lcsc/2005221232_SHOU-HAN-TS342A2P-WZ_C557591.pdf; ComponentLink2Description: LCSC Link; ComponentLink2URL: https://www.lcsc.com/product-detail/Tactile-Switches_SHOU-HAN-TS342A2P-WZ_C557591.html; Manufacturer Part Number: TS342A2P-WZ; JLCPCB Part Number: C557591; Package: SMD; Contact Current: 50mA; Switch Length: 3.95mm; Insulation Resistance: 100MΩ; Voltage Rating (DC): 12V; Switch Width: 2.9mm; Actuator/Cap Color: Black; Actuator Style: Round Button; Mounting Style: Brick nogging; Circuit: SPST
TP1-TP4 = TEST POINT_1(I/O): 1.5x1.5mm Test Point(I/O)